# EAGLE design main (EAGLE 7.7.0)
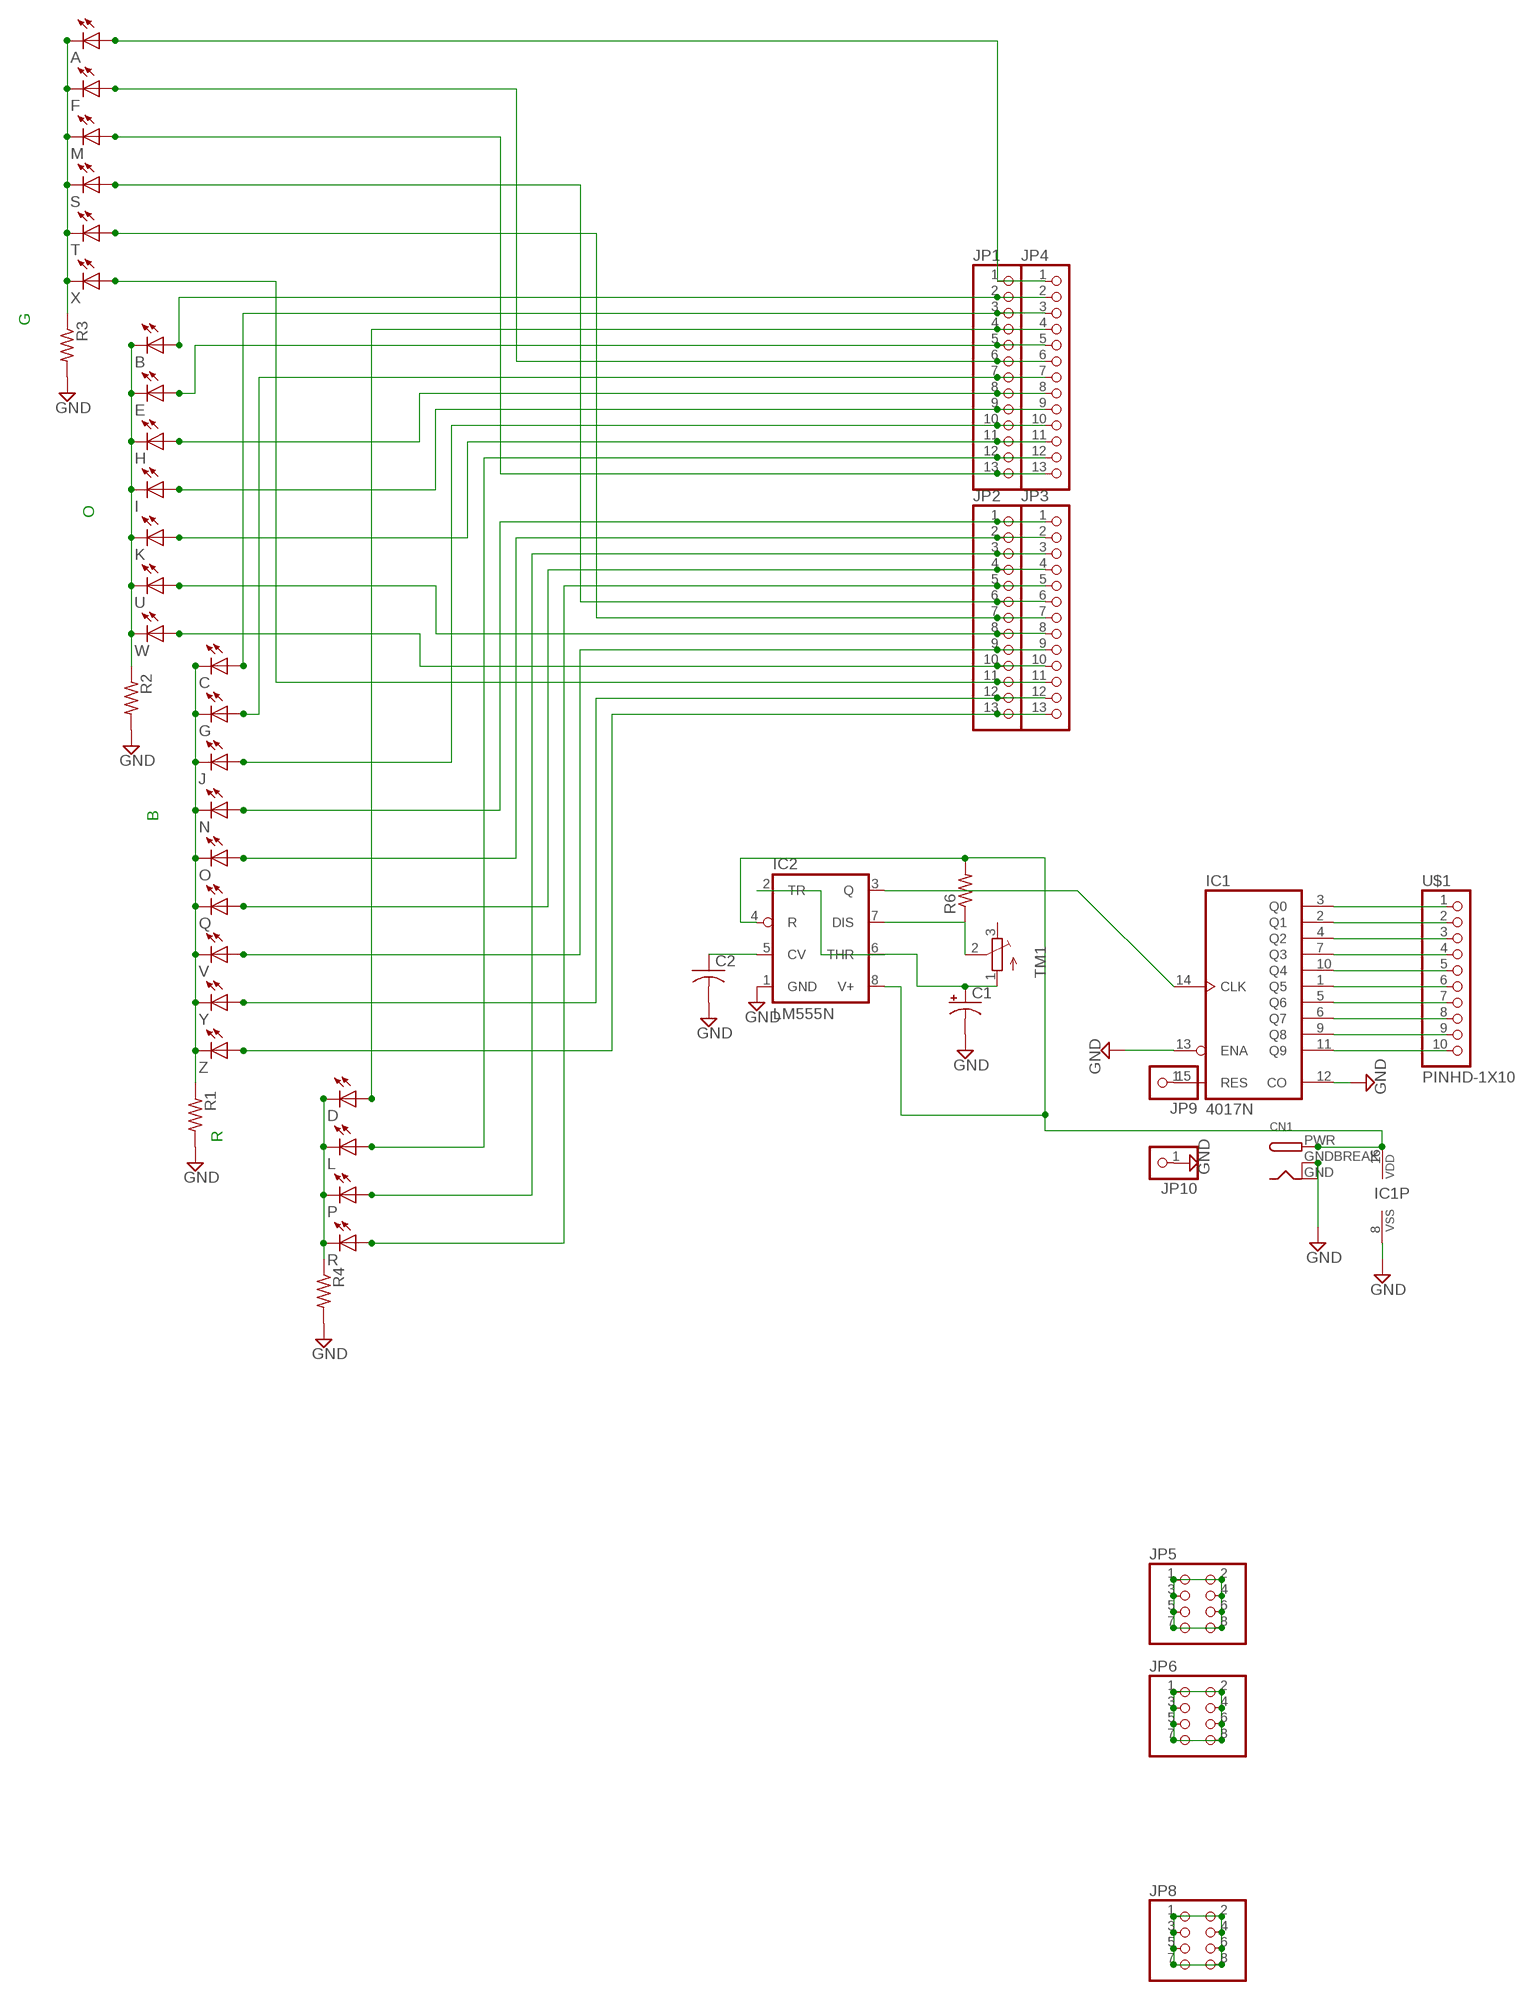
[diagram p0: schematic, sheet 1]

## Parts
A  LED3MM  [LED3MM]
B  LED3MM  [LED3MM]
C  LED3MM  [LED3MM]
C1  CPOL-USE3.5-10  [E3,5-10]
C2  C-US025-024X044  [C025-024X044]
CN1  DCBARRELPTH  [DCJACK_2MM_PTH]
D  LED3MM  [LED3MM]
E  LED3MM  [LED3MM]
F  LED3MM  [LED3MM]
G  LED3MM  [LED3MM]
H  LED3MM  [LED3MM]
I  LED3MM  [LED3MM]
IC1  4017N  [DIL16]
IC2  LM555N  [DIL08]
J  LED3MM  [LED3MM]
JP1  PINHD-1X13  [1X13]
JP2  PINHD-1X13  [1X13]
JP3  PINHD-1X13  [1X13]
JP4  PINHD-1X13  [1X13]
JP5  PINHD-2X4  [2X04]
JP6  PINHD-2X4  [2X04]
JP8  PINHD-2X4  [2X04]
JP9  PINHD-1X1  [1X01]
JP10  PINHD-1X1  [1X01]
K  LED3MM  [LED3MM]
L  LED3MM  [LED3MM]
M  LED3MM  [LED3MM]
N  LED3MM  [LED3MM]
O  LED3MM  [LED3MM]
P  LED3MM  [LED3MM]
Q  LED3MM  [LED3MM]
R  LED3MM  [LED3MM]
R1  R-US_0207/7  [0207/7]
R2  R-US_0207/7  [0207/7]
R3  R-US_0207/7  [0207/7]
R4  R-US_0207/7  [0207/7]
R6  R-US_0207/7  [0207/7]
S  LED3MM  [LED3MM]
T  LED3MM  [LED3MM]
TM1  TRIMPOT3386  [TRIM-3386]
U  LED3MM  [LED3MM]
U$1  PINHD-1X10  [1X10-BIG]
V  LED3MM  [LED3MM]
W  LED3MM  [LED3MM]
X  LED3MM  [LED3MM]
Y  LED3MM  [LED3MM]
Z  LED3MM  [LED3MM]

## Nets
A: A.K(C) F.K(C) M.K(C) R3.1 S.K(C) T.K(C) X.K(C)
GND: C1.- C2.2 CN1.GND CN1.GNDBREAK IC1.8(VSS) IC1.12(CO) IC1.13(ENA) IC2.1(GND) JP10.1 R1.2 R2.2 R3.2 R4.2
N$2: B.K(C) E.K(C) H.K(C) I.K(C) K.K(C) R2.1 U.K(C) W.K(C)
N$4: D.K(C) L.K(C) P.K(C) R4.1 R.K(C)
N$5: IC1.3(Q0) U$1.1
N$6: IC1.2(Q1) U$1.2
N$7: IC1.4(Q2) U$1.3
N$8: IC1.7(Q3) U$1.4
N$9: IC1.10(Q4) U$1.5
N$10: IC1.1(Q5) U$1.6
N$11: IC1.5(Q6) U$1.7
N$12: IC1.6(Q7) U$1.8
N$13: IC1.9(Q8) U$1.9
N$14: IC1.11(Q9) U$1.10
N$15: CN1.PWR IC1.16(VDD) IC2.4(R) IC2.8(V+) R6.2
N$16: A.A JP1.1 JP4.1
N$17: B.A JP1.2 JP4.2
N$19: JP1.12 JP4.12 L.A
N$21: F.A JP1.6 JP4.6
N$22: IC1.15(RES) JP9.1
N$23: G.A JP1.7 JP4.7
N$25: JP2.2 JP3.2 O.A
N$26: JP1.11 JP4.11 K.A
N$30: C1.+ IC2.2(TR) IC2.6(THR) TM1.1(A)
N$31: JP2.3 JP3.3 P.A
N$40: JP2.12 JP3.12 Y.A
N$41: JP2.13 JP3.13 Z.A
N$42: JP5.1 JP5.2 JP5.3 JP5.4 JP5.5 JP5.6 JP5.7 JP5.8
N$43: JP6.1 JP6.2 JP6.3 JP6.4 JP6.5 JP6.6 JP6.7 JP6.8
N$45: JP8.1 JP8.2 JP8.3 JP8.4 JP8.5 JP8.6 JP8.7 JP8.8
N$46: J.A JP1.10 JP4.10
N$47: IC2.7(DIS) R6.1 TM1.2(S)
N$48: D.A JP1.4 JP4.4
N$49: C2.1 IC2.5(CV)
N$51: IC1.14(CLK) IC2.3(Q)
N$53: I.A JP1.9 JP4.9
N$55: JP1.13 JP4.13 M.A
N$56: JP2.1 JP3.1 N.A
N$57: JP2.4 JP3.4 Q.A
N$58: JP2.6 JP3.6 S.A
N$59: JP2.7 JP3.7 T.A
N$60: JP2.8 JP3.8 U.A
N$61: JP2.9 JP3.9 V.A
N$62: JP2.10 JP3.10 W.A
N$63: JP2.11 JP3.11 X.A
N$69: JP2.5 JP3.5 R.A
N$71: H.A JP1.8 JP4.8
N$72: E.A JP1.5 JP4.5
N$73: C.A JP1.3 JP4.3
RGND: C.K(C) G.K(C) J.K(C) N.K(C) O.K(C) Q.K(C) R1.1 V.K(C) Y.K(C) Z.K(C)
Unconnected: TM1.3(E)

## Notes on the sheet
- G
- O
- B
- R

## Library data of the parts
A B C D E F G H I J K L M N O P Q R S T U V W X Y Z = adafruit:LED: LED OSRAM: - CHIPLED LG R971, LG N971, LY N971, LG Q971, LY Q971, LO R971, LY R971 LH N974, LH R974 LS Q976, LO Q976, LY Q976 LO Q996 - Hyper CHIPLED LW Q18S LB Q993, LB Q99A, LB R99A - SideLED LS A670, LO A670, LY A670, LG A670, LP A670 LB A673, LV A673, LT A673, LW A673 LH A674 LY A675 LS A676, LA A676, LO A676, LY A676, LW A676 LS A679, LY A679, LG A679 - Hyper Micro SIDELED® LS Y876, LA Y876, LO Y876, LY Y876 LT Y87S - SmartLED LW L88C, LW L88S LB L89C, LB L89S, LG L890 LS L89K, LO L89K, LY L89K LS L896, LA L896, LO L896, LY L896 - TOPLED LS T670, LO T670, LY T670, LG T670, LP T670 LSG T670, LSP T670, LSY T670, LOP T670, LYG T670 LG T671, LOG T671, LSG T671 LB T673, LV T673, LT T673, LW T673 LH T674 LS T676, LA T676, LO T676, LY T676, LB T676, LH T676, LSB T676, LW T676 LB T67C, LV T67C, LT T67C, LS T67K, LO T67K, LY T67K, LW E67C LS E67B, LA E67B, LO E67B, LY E67B, LB E67C, LV E67C, LT E67C LW T67C LS T679, LY T679, LG T679 LS T770, LO T770, LY T770, LG T770, LP T770 LB T773, LV T773, LT T773, LW T773 LH T774 LS E675, LA E675, LY E675, LS T675 LS T776, LA T776, LO T776, LY T776, LB T776 LHGB T686 LT T68C, LB T68C - Hyper Mini TOPLED® LB M676 - Mini TOPLED Santana® LG M470 LS M47K, LO M47K, LY M47K Source: http://www.osram.convergy.de/
C1 = adafruit:CPOL-US: POLARIZED CAPACITOR, American symbol
C2 = adafruit:C-US: CAPACITOR, American symbol
CN1 = adafruit:DCBARREL: 2.0mm DC Barrel Jack DCJACK_2MM_PTH - Through Hole Jack (4UConnector: 05537)
IC1 = 40xx:4017: COUNTER/DIVIDER
IC2 = linear:*555: TIMER
JP1-JP4 = adafruit:PINHD-1X13: PIN HEADER
JP5 JP6 JP8 = adafruit:PINHD-2X4: PIN HEADER
JP9 JP10 = adafruit:PINHD-1X1: Pin header 1x1 for 0.1" spacing With round pins
R1-R4 R6 = adafruit:R-US_: RESISTOR, American symbol
TM1 = adafruit:TRIMPOT: SMT trimmer potentiometer part number TC33X http://www.ladyada.net/library/eagle
U$1 = adafruit:PINHD-1X10: Pin header 1x10 0.1" spacing With round pins

## Board
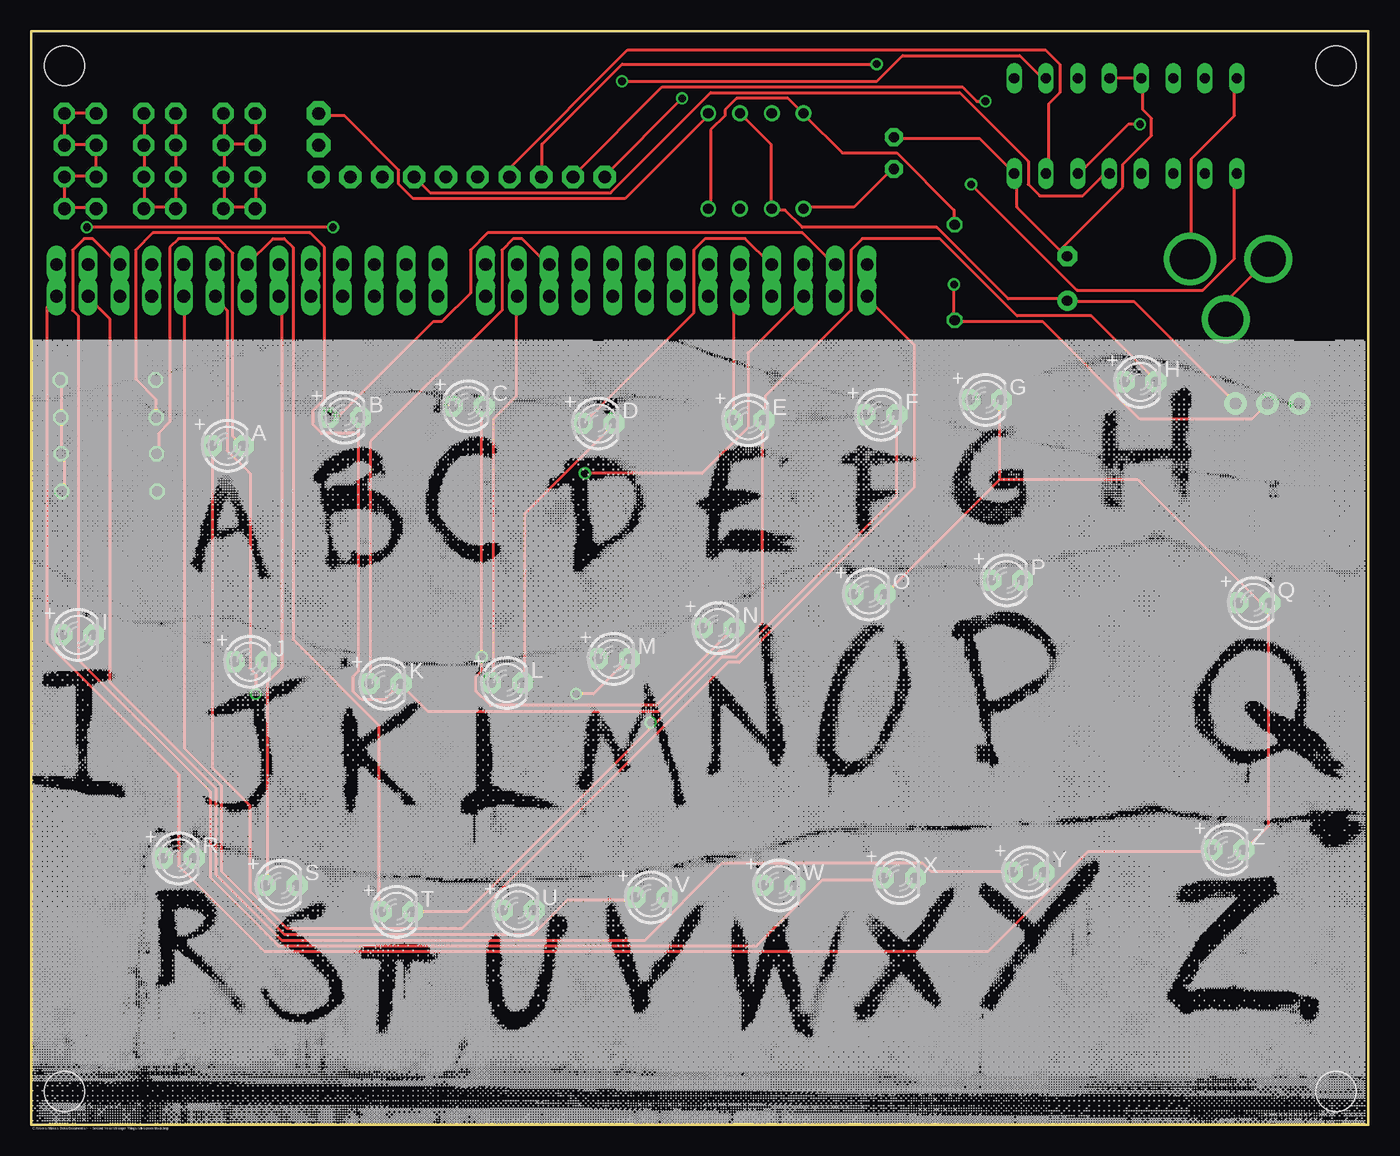
[diagram p1: board, top side]
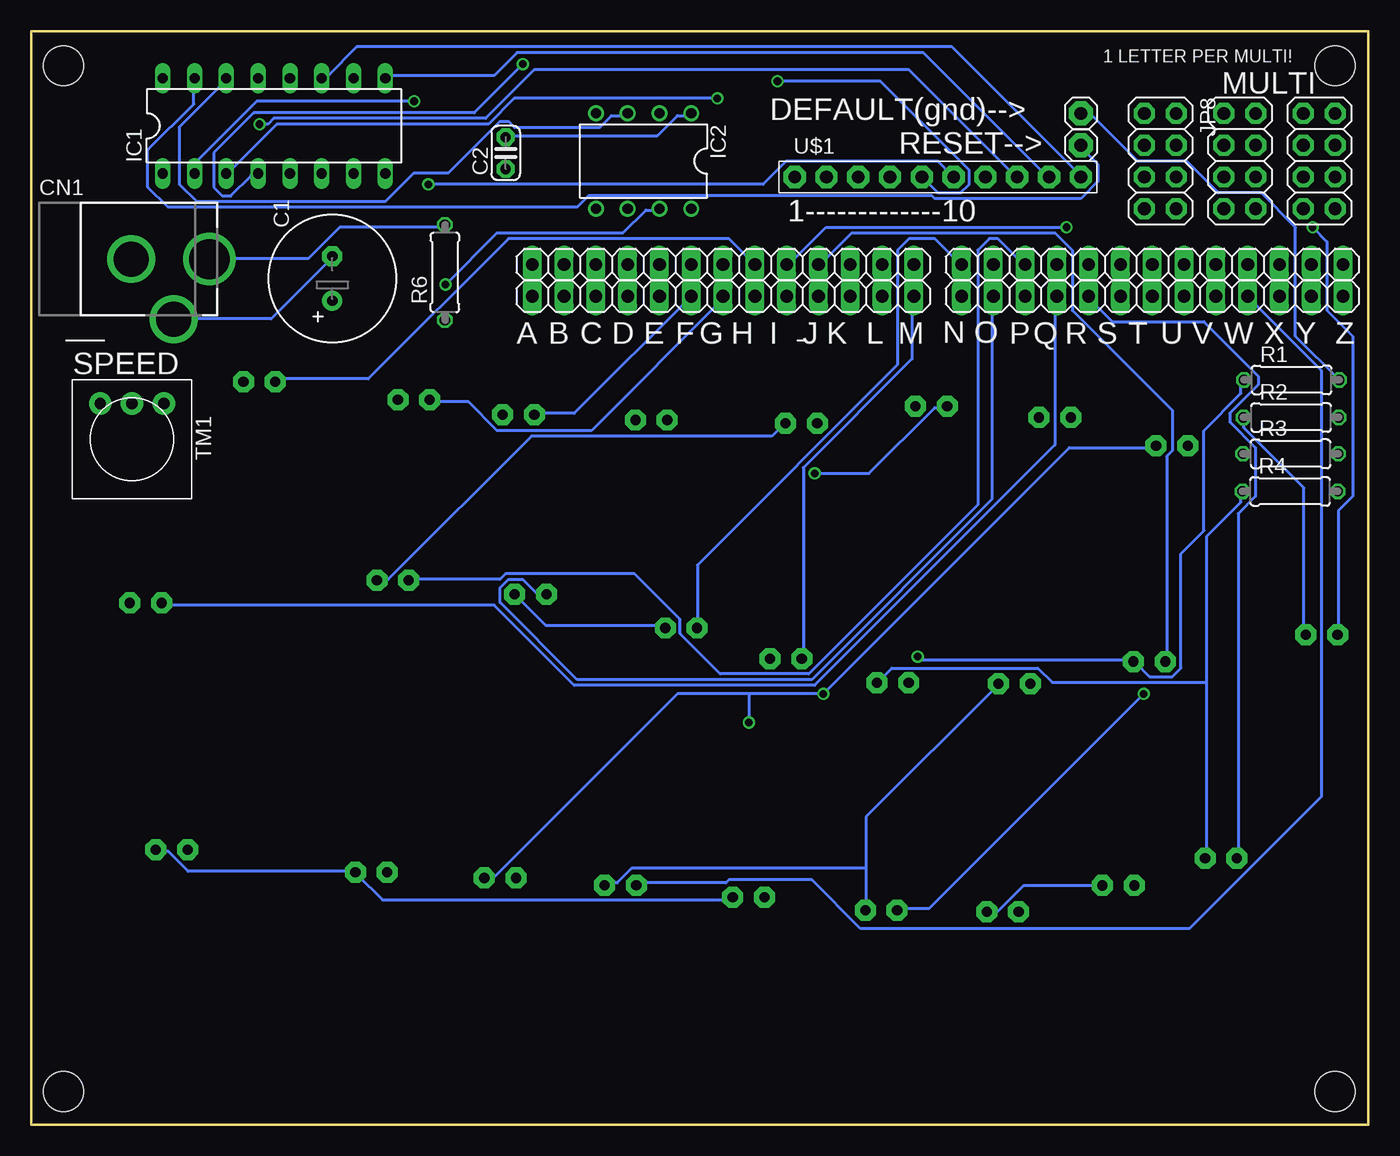
[diagram p2: board, bottom side, seen from below]

Size 106.8 x 87.3 mm. Coordinates in mm from the lower left corner, seen from the top.
Outline: 0,0 106.8,0 106.8,87.3 0,87.3 0,0.1
Copper layers (1*16): Top 0.0356mm / dielectric 1.5011mm / Bottom 0.0356mm
Design rules "oshpark-2layer": minimum track width 6mil, minimum drill 13mil, track to track 6mil, track to pad 6mil, pad to pad 6mil, via to via 6mil, smd to smd 6mil, copper to edge 15mil, drill to drill 6mil, minimum pad ring 7mil, minimum via ring 7mil, stop-mask expansion 2.5mil, vias tented up to drill 0mil, thermal gap 10mil
Holes 3.2 mm at 2.64,84.55 104.24,84.55 104.24,2.64 2.64,2.64

### Footprints (pad centres in the part's own frame; a part is rotated, then mirrored left to right if it is on the bottom)
LED3MM = drill 0.813 pad 1.676 octagon: A -1.27,0; K 1.27,0
E3,5-10 = drill 0.813 pad 1.6: + -1.778,0 | drill 0.813 pad 1.6 octagon: - 1.778,0
C025-024X044 = drill 0.813 pad 1.422 octagon: 1 -1.27,0; 2 1.27,0
DCJACK_2MM_PTH = drill 2.8: GND 0,7.35; GNDBREAK 4.8,10.75 | drill 3.2: PWR 0,13.6
DIL16 = drill 0.813 long: 1 -8.89,-3.81; 2 -6.35,-3.81; 3 -3.81,-3.81; 4 -1.27,-3.81; 5 1.27,-3.81; 6 3.81,-3.81; 7 6.35,-3.81; 8 8.89,-3.81; 9 8.89,3.81; 10 6.35,3.81; 11 3.81,3.81; 12 1.27,3.81; 13 -1.27,3.81; 14 -3.81,3.81; 15 -6.35,3.81; 16 -8.89,3.81
DIL08 = drill 0.813 pad 1.27: 1 -3.81,-3.81; 2 -1.27,-3.81; 3 1.27,-3.81; 4 3.81,-3.81; 5 3.81,3.81; 6 1.27,3.81; 7 -1.27,3.81; 8 -3.81,3.81
1X13 = drill 1.016 long: 1 -15.24,0; 2 -12.7,0; 3 -10.16,0; 4 -7.62,0; 5 -5.08,0; 6 -2.54,0; 7 0,0; 8 2.54,0; 9 5.08,0; 10 7.62,0; 11 10.16,0; 12 12.7,0; 13 15.24,0
2X04 = drill 1.016 pad 1.676 octagon: 1 -3.81,-1.27; 2 -3.81,1.27; 3 -1.27,-1.27; 4 -1.27,1.27; 5 1.27,-1.27; 6 1.27,1.27; 7 3.81,-1.27; 8 3.81,1.27
1X01 = drill 1.016 pad 1.93 octagon: 1 0,0
0207/7 = drill 0.813 octagon: 1 -3.81,0; 2 3.81,0
TRIM-3386 = drill 0.9 pad 1.778: 1 -2.54,-2.857; 2 0,-2.857; 3 2.54,-2.857
1X10-BIG = drill 1.016 pad 1.778 octagon: 1 -11.43,0; 2 -8.89,0; 3 -6.35,0; 4 -3.81,0; 5 -1.27,0; 6 1.27,0; 7 3.81,0; 8 6.35,0; 9 8.89,0; 10 11.43,0

### Placement (x,y rotation side)
A  15.68,54.21 0 top
B  25.03,56.46 0 top
C  34.9,57.37 0 top
C1  82.75,67.56 90 bottom
C2  68.9,77.58 90 bottom
CN1  106.17,69.11 270 bottom
D  45.28,55.99 0 top
E  57.27,56.26 0 top
F  67.88,56.69 0 top
G  76.24,57.87 0 top
H  88.58,59.31 0 top
I  3.72,39.11 0 top
IC1  87.41,79.75 0 bottom
IC2  57.88,76.93 180 bottom
J  17.48,36.97 0 top
JP1  51.54,68.68 0 bottom
JP2  17.25,68.68 0 bottom
JP3  17.25,66.14 0 bottom
JP4  51.54,66.14 0 bottom
JP5  3.91,76.93 270 bottom
JP6  10.26,76.93 270 bottom
JP8  16.61,76.93 270 bottom
JP9  22.96,78.2 0 bottom
JP10  22.96,80.74 0 bottom
K  28.26,35.21 0 top
L  37.98,35.27 0 top
M  46.52,37.19 0 top
N  54.88,39.65 0 top
O  66.92,42.35 0 top
P  77.92,43.47 0 top
Q  97.66,41.65 0 top
R  11.76,21.27 0 top
R1  6.12,59.46 0 bottom
R2  6.16,56.46 0 bottom
R3  6.2,53.56 0 bottom
R4  6.24,50.56 0 bottom
R6  73.76,68.04 90 bottom
S  19.96,19.09 0 top
T  29.2,16.99 0 top
TM1  98.75,54.73 180 bottom
U  38.9,17.11 0 top
U$1  34.39,75.66 0 bottom
V  49.5,18.15 0 top
W  59.74,19.11 0 top
X  69.34,19.69 0 top
Y  79.64,20.15 0 top
Z  95.58,21.95 0 top

### Tracks (layer width: path | path; a pad name or v marks a point on that pad's centre or on a via)
A  (via drill 0.61)
  Top 0.254: 49.71,31.88 34.85,17.02 30.5,17.02 T.K | 49.71,31.88 55.19,37.36 56.34,37.36 69.14,50.16 69.14,56.56 F.K | R3.1 10.16,53.59 10.16,55.19 11.07,56.11 11.07,70.05 11.76,70.74 14.96,70.74 16.1,69.59 16.1,54.96 16.79,54.28 A.K | v43.53,34.39 44.91,34.39 47.65,37.13 M.K | v49.48,32.1 49.71,31.88
  Bottom 0.254: T.K 30.28,17.02 29.59,17.02 27.53,19.07 21.36,19.07 S.K | 49.48,34.39 v43.53,34.39 23.87,54.05 17.02,54.05 A.K | 49.48,34.39 55.19,34.39 69.82,19.76 70.51,19.76 X.K | 49.48,34.39 v49.48,32.1
GND
  Top 0.254: R1.2 2.39,59.31 2.39,56.56 R2.2 2.39,56.34 2.39,53.59 R3.2 2.62,53.36 2.62,50.62 R4.2 | CN1.GNDBREAK 95.43,64.34 95.43,65.71 98.63,68.91 CN1.GND | IC1.12 86.28,83.54 88.57,83.54 IC1.13 88.8,83.54 88.8,81.02 89.48,80.34 89.48,78.97 87.2,76.68 87.2,74.85 82.17,69.82 | 82.17,69.82 82.62,69.37 C1.- 82.17,69.82 | 82.17,69.82 78.74,73.25 78.74,75.77 IC1.8 78.51,75.99 75.77,78.74 68.91,78.74 C2.2 | JP10.1 22.96,80.57 25.02,80.57 29.36,76.22 29.36,75.08 30.5,73.94 47.42,73.94 54.05,80.57 IC2.1
  Bottom 0.254: R1.2 5.81,62.97 5.81,71.65 8.56,74.39 11.99,74.39 14.5,76.91 18.39,76.91 22.05,80.57 22.96,80.57 JP10.1 | IC2.1 54.28,80.57 55.19,80.57 56.79,78.97 68.68,78.97 C2.2 | CN1.GNDBREAK 95.2,64.34 87.65,64.34 82.85,69.14 C1.-
N$2
  Top 0.254: H.K 89.71,59.54 84.68,64.56 78.74,64.56 72.57,70.74 66.39,70.74 65.48,69.82 65.48,65.02 58.62,58.16 58.62,56.34 E.K 58.39,56.11 58.39,40.11 56.11,37.82 54.96,37.82 50.16,33.02 31.65,33.02 29.59,35.08 K.K 29.36,35.08 28.22,33.93 26.39,33.93 25.7,34.62 25.7,35.76 26.16,36.22 26.16,55.19 | 26.16,55.19 26.16,56.34 B.K | 26.16,55.19 23.19,55.19 22.5,55.88 22.5,57.02 23.42,57.94 23.42,70.05 22.27,71.19 9.7,71.19 8.33,69.82 8.33,59.54 9.93,57.94 9.93,56.56 R2.1
  Bottom 0.254: R2.1 9.93,56.34 9.93,55.65 5.13,50.85 5.13,39.19 I.K | 40.11,20.45 40.11,24.56 29.59,35.08 K.K | 40.11,20.45 40.11,17.25 U.K | 40.11,20.45 58.85,20.45 59.99,19.3 60.91,19.3 W.K
N$4
  Top 0.254: L.K 39.42,35.3 39.42,48.79 46.51,55.88 D.K
  Bottom 0.254: 12.9,35.3 12.9,21.36 R.K | 12.9,35.3 12.9,46.96 10.16,49.71 10.16,50.39 R4.1 | P.K 78.97,43.53 78.28,43.53 66.85,54.96 47.65,54.96 46.73,55.88 D.K | 12.9,35.3 25.25,35.3 26.39,36.45 38.05,36.45 39.19,35.3 L.K
N$5  (via drill 0.61)
  Top 0.254: v51.99,81.94 45.82,75.77 U$1.1
  Bottom 0.254: v51.99,81.94 68.22,81.94 70.28,79.88 87.2,79.88 91.08,75.99 IC1.3
N$6  (via drill 0.61)
  Top 0.254: v76.22,81.71 75.54,81.71 74.39,82.85 50.39,82.85 43.3,75.77 U$1.2
  Bottom 0.254: v76.22,81.71 88.8,81.71 93.6,76.91 93.6,75.99 IC1.2
N$7  (via drill 0.61)
  Top 0.254: v67.54,84.68 47.19,84.68 40.79,78.28 40.79,75.77 U$1.3
  Bottom 0.254: v67.54,84.68 71.42,80.8 89.02,80.8 92.23,77.59 92.23,74.85 91.54,74.17 90.85,74.17 89.25,75.77 88.8,75.77 IC1.4
N$8
  Top 0.254: IC1.7 81.25,75.99 81.25,81.48 82.17,82.4 82.17,84.68 81.02,85.82 47.65,85.82 38.28,76.45 38.28,75.77 U$1.4
N$9  (via drill 0.61)
  Top 0.254: v47.19,83.31 67.54,83.31 69.59,85.37 78.97,85.37 80.57,83.77 81.02,83.77 IC1.10
  Bottom 0.254: v47.19,83.31 38.96,83.31 31.88,76.22 31.88,75.08 32.56,74.39 34.39,74.39 U$1.5
N$10  (via drill 0.61)
  Top 0.254: v75.08,75.08 83.54,66.62 93.6,66.62 96.11,69.14 96.11,75.77 IC1.1
  Bottom 0.254: v75.08,75.08 48.34,75.08 46.51,76.91 34.39,76.91 33.25,75.77 U$1.6
N$11
  Top 0.254: IC1.5 86.05,75.77 85.6,75.77 84,74.17 80.57,74.17 79.65,75.08 79.65,76.91 74.17,82.4 54.28,82.4 46.28,74.39 31.88,74.39 30.73,75.54 U$1.7
N$12  (via drill 0.61)
  Top 0.254: v88.57,79.88 87.65,79.88 83.77,75.99 IC1.6
  Bottom 0.254: v88.57,79.88 87.88,79.88 87.42,80.34 70.51,80.34 66.62,84.22 36.68,84.22 28.22,75.77 U$1.8
N$13
  Bottom 0.254: IC1.9 78.51,83.77 69.82,83.77 67.99,85.6 35.53,85.6 25.7,75.77 U$1.9
N$14
  Bottom 0.254: IC1.11 83.54,83.77 83.08,83.77 80.8,86.05 33.25,86.05 22.96,75.77 U$1.10
N$15
  Top 0.254: IC1.16 96.11,83.54 96.11,80.57 92.68,77.14 92.68,69.14 CN1.PWR | IC2.8 54.28,73.25 54.28,79.42 55.42,80.57 55.42,81.02 56.34,81.94 60.45,81.94 61.59,80.8 IC2.4 61.82,80.57 64.79,77.59 69.14,77.59 73.71,73.02 73.71,71.88 R6.2
  Bottom 0.254: CN1.PWR 92.45,69.14 84.68,69.14 82.17,71.65 73.94,71.65 R6.2
N$16
  Top 0.254: JP1.1 66.85,68.68 66.85,66.16 JP4.1 66.85,65.94 70.51,62.28 70.51,50.85 56.56,36.91 55.65,36.91 34.39,15.64 20.45,15.64 17.47,18.62 17.47,25.48 14.5,28.45 14.5,54.05 A.A
N$17
  Top 0.254: JP4.2 64.34,66.16 64.34,68.68 JP1.2 64.11,68.68 61.59,71.19 36.45,71.19 35.08,69.82 35.08,66.39 32.79,64.11 32.1,64.11 24.56,56.56 23.87,56.56 B.A
N$19
  Top 0.254: JP1.12 38.96,68.68 38.96,66.16 JP4.12 38.73,65.94 38.73,58.16 36.91,56.34 36.91,35.3 L.A
N$21
  Top 0.254: JP4.6 54.05,66.16 54.05,68.68 JP1.6
  Bottom 0.254: JP4.6 63.42,56.79 66.39,56.79 F.A
N$22
  Bottom 0.254: IC1.15 93.83,83.54 93.83,81.48 97.48,77.82 97.48,74.85 95.88,73.25 63.19,73.25 62.28,74.17 34.85,74.17 34.62,73.94 22.96,73.94 21.59,75.31 21.59,76.68 22.96,78.05 JP9.1
N$23
  Top 0.254: JP1.7 JP4.7
  Bottom 0.254: G.A 74.85,57.71 71.88,57.71 69.59,55.42 62.05,55.42 51.54,65.94 JP4.7
N$25
  Top 0.254: JP3.2 30.05,66.16 30.05,68.68 JP2.2
  Bottom 0.254: O.A 65.71,42.39 66.39,42.39 67.54,43.53 68.68,43.53 69.37,42.85 69.37,41.7 63.19,35.53 44.45,35.53 30.05,49.94 30.05,65.94 JP3.2
N$26
  Top 0.254: JP4.11 41.48,66.16 41.48,68.68 JP1.11 41.25,68.68 39.19,70.74 38.51,70.74 37.59,69.82 37.59,65.02 27.08,54.51 27.08,35.3 K.A
N$30
  Top 0.254: IC2.2 59.08,78.28 59.08,73.25 IC2.6 59.31,73.02 60.22,73.02 61.59,71.65 72.34,71.65 78.05,65.94 82.62,65.94 C1.+ 82.85,65.71 88.11,65.71 96.11,57.71 TM1.1
N$31
  Top 0.254: JP3.3 27.53,66.16 27.53,68.68 JP2.3
  Bottom 0.254: P.A 76.45,43.53 69.37,43.53 68.91,43.99 58.62,43.99 54.96,40.33 54.96,39.19 51.76,35.99 44.68,35.99 31.19,49.48 31.19,69.82 30.28,70.74 29.59,70.74 27.53,68.68 JP2.3
N$40
  Top 0.254: JP2.12 4.67,68.68 4.67,66.16 JP3.12 4.67,65.94 6.27,64.34 6.27,35.3 14.73,26.85 14.73,19.99 19.99,14.73 49.02,14.73 55.19,20.9 71.19,20.9 71.88,20.22 78.28,20.22 Y.A
N$41
  Top 0.254: JP2.13 2.16,68.68 2.16,66.16 JP3.13 1.93,65.94 1.24,65.25 1.24,38.51 11.76,27.99 11.76,20.67 18.62,13.82 76.45,13.82 84.45,21.82 94.28,21.82 Z.A
N$42
  Top 0.254: JP5.7 5.13,73.25 2.84,73.25 JP5.8 2.62,73.25 2.62,75.54 JP5.6 2.84,75.77 5.13,75.77 | JP5.1 5.13,80.8 2.84,80.8 JP5.2 2.62,80.57 2.62,78.28 JP5.4 2.84,78.28 5.13,78.28 JP5.3 5.13,78.05 5.13,75.77 | 5.13,75.77 JP5.5
N$43
  Top 0.254: 9.01,73.25 9.01,75.54 JP6.6 9.01,75.77 9.01,78.05 JP6.4 9.01,78.28 9.01,80.57 JP6.2 | 11.53,73.25 JP6.5 JP6.3 JP6.1 | 11.53,73.25 9.01,73.25 | 9.01,73.25 JP6.8 | 11.53,73.25 JP6.7
N$45
  Top 0.254: 15.42,73.25 15.42,75.54 JP8.6 15.42,75.77 15.42,78.05 JP8.4 15.42,78.28 | JP8.5 17.93,75.54 17.93,73.25 JP8.7 17.7,73.25 15.42,73.25 | 15.42,73.25 JP8.8 | 15.42,78.28 15.42,80.57 JP8.2 | JP8.1 17.93,80.57 17.93,78.28 JP8.3 17.7,78.28 15.42,78.28
N$46
  Top 0.254: JP4.10 43.99,66.16 43.99,68.68 JP1.10
  Bottom 0.254: J.A 16.1,37.13 16.1,53.36 15.64,53.82 15.64,57.02 23.65,65.02 23.65,69.82 25.02,71.19 41.25,71.19 43.76,68.68 JP1.10
N$47  (via drill 0.61)
  Top 0.254: TM1.2 98.63,57.48 97.48,56.34 88.57,56.34 80.8,64.11 73.94,64.11 R6.1 73.71,64.34 v73.71,67.08
  Bottom 0.254: v73.71,67.08 69.59,71.19 59.54,71.19 57.71,73.02 56.79,73.02 IC2.7
N$48
  Top 0.254: JP4.4 59.31,66.16 59.31,68.68 JP1.4 59.08,68.68 57.02,70.74 53.82,70.74 52.91,69.82 52.91,64.79 44.22,56.11 D.A
N$49
  Top 0.254: IC2.5 61.82,73.25 65.71,73.25 68.68,76.22 C2.1
N$51
  Bottom 0.254: IC2.3 59.31,80.57 60.45,80.57 61.37,79.65 68.22,79.65 68.68,80.11 69.37,80.11 73.48,75.99 76.22,75.99 78.51,73.71 93.6,73.71 94.97,75.08 94.97,79.65 91.08,83.54 IC1.14
N$53  (via drill 0.61)
  Top 0.254: JP4.9 46.51,66.16 46.51,68.68 JP1.9 | v24.1,71.65 v4.44,71.65
  Bottom 0.254: v4.44,71.65 3.3,70.51 3.3,65.02 1.24,62.97 1.24,50.16 2.39,49.02 2.39,39.19 I.A | v24.1,71.65 43.3,71.65 46.28,68.68 JP1.9
N$55
  Top 0.254: JP4.13 36.45,66.16 36.45,68.68 JP1.13
  Bottom 0.254: M.A 45.13,37.36 45.13,52.45 36.45,61.14 36.45,65.94 JP4.13
N$56
  Top 0.254: JP3.1 32.56,66.16 32.56,68.68 JP2.1
  Bottom 0.254: N.A 53.59,39.88 53.59,44.68 37.59,60.68 37.59,69.82 36.68,70.74 34.62,70.74 32.56,68.68 JP2.1
N$57
  Top 0.254: JP3.4 25.02,66.16 25.02,68.68 JP2.4
  Bottom 0.254: Q.A 96.34,41.48 69.82,41.48 63.42,35.08 44.22,35.08 25.02,54.28 25.02,65.94 JP3.4
N$58
  Top 0.254: JP2.6 19.76,68.68 19.76,66.16 JP3.6 19.99,65.94 19.99,36.45 18.85,35.3 18.85,19.3 S.A
N$59
  Top 0.254: JP3.7 JP2.7 19.3,70.74 20.22,70.74 20.9,70.05 20.9,38.73 27.76,31.88 27.76,17.02 T.A
N$60  (via drill 0.61)
  Top 0.254: JP2.8 14.73,68.68 14.73,66.16 JP3.8 14.73,65.94 15.64,65.02 15.64,53.82 17.47,51.99 17.47,36.45 17.93,35.99 v17.93,34.39
  Bottom 0.254: v17.93,34.39 35.08,17.25 37.59,17.25 U.A
N$61
  Top 0.254: JP2.9 12.22,68.68 12.22,66.16 JP3.9 12.22,65.94 12.22,30.05 15.19,27.08 15.19,20.22 20.22,15.19 40.11,15.19 42.85,17.93 48.11,17.93 V.A
N$62
  Top 0.254: JP3.10 9.7,66.16 9.7,68.68 JP2.10
  Bottom 0.254: W.A 58.39,19.3 51.31,19.3 51.08,19.53 44.45,19.53 40.56,15.64 14.27,15.64 3.76,26.16 3.76,60.22 9.47,65.94 JP3.10
N$63
  Top 0.254: JP3.11 7.19,66.16 7.19,68.68 JP2.11 6.96,68.68 4.9,70.74 4.21,70.74 3.3,69.82 3.3,65.02 3.76,64.56 3.76,37.13 14.27,26.62 14.27,19.76 19.76,14.27 57.94,14.27 63.19,19.53 67.99,19.53 X.A
N$69
  Top 0.254: JP3.5 22.27,66.16 22.27,68.68 JP2.5
  Bottom 0.254: R.A 10.39,21.36 10.39,48.79 9.01,50.16 9.01,54.05 11.07,56.11 11.07,56.79 8.79,59.08 8.79,59.77 13.13,64.11 20.45,64.11 22.27,65.94 JP3.5
N$71
  Top 0.254: JP4.8 49.02,66.16 49.02,68.68 JP1.8
  Bottom 0.254: H.A 87.2,59.54 79.88,59.54 68.68,70.74 51.08,70.74 49.02,68.68 JP1.8
N$72
  Top 0.254: JP1.5 56.56,68.68 56.56,66.16 JP4.5 56.56,65.94 56.11,65.48 56.11,56.34 E.A
N$73  (via drill 0.61)
  Top 0.254: JP1.3 61.82,68.68 61.82,66.16 JP4.3 61.59,65.94 57.25,61.59 57.25,55.65 53.59,51.99 v44.22,51.99
  Bottom 0.254: v44.22,51.99 39.88,51.99 34.62,57.25 33.7,57.25 C.A
RGND  (via drill 0.61)
  Top 0.254: Z.K 97.03,22.05 98.85,23.87 98.85,41.48 Q.K 98.85,41.7 98.17,41.7 88.34,51.54 77.37,51.54 | C.K 35.99,57.25 v35.99,37.36 35.99,36.22 35.53,35.76 35.53,34.62 36.68,33.48 49.94,33.48 56.11,39.65 N.K | 77.37,51.54 77.37,57.71 G.K | 77.37,51.54 68.22,42.39 O.K
  Bottom 0.254: V.K 50.85,17.93 78.74,17.93 80.8,19.99 Y.K 81.02,20.22 94.28,20.22 95.88,21.82 96.8,21.82 Z.K | R1.1 10.16,59.31 10.16,58.39 13.13,55.42 13.13,47.42 14.96,45.59 14.96,36.45 15.64,35.76 17.47,35.76 18.62,36.91 J.K 18.85,37.13 35.76,37.13 v35.99,37.36 | N.K 56.34,39.88 65.71,39.88 67.99,42.16 O.K

### Text on the board
tPlace: C:/Users/Iltimas Doha/Documents/~ ~ Second Year/stranger Things/silkscreen black.bmp
bPlace: 1 LETTER PER MULTI! | MULTI | DEFAULT(gnd)--> | RESET--> | 1-------------10 | Z | Y | X | W | V | U | T | S | R | Q | P | O | N | M | L | K | J | I | H | G | F | E | D | C | B | A | SPEED